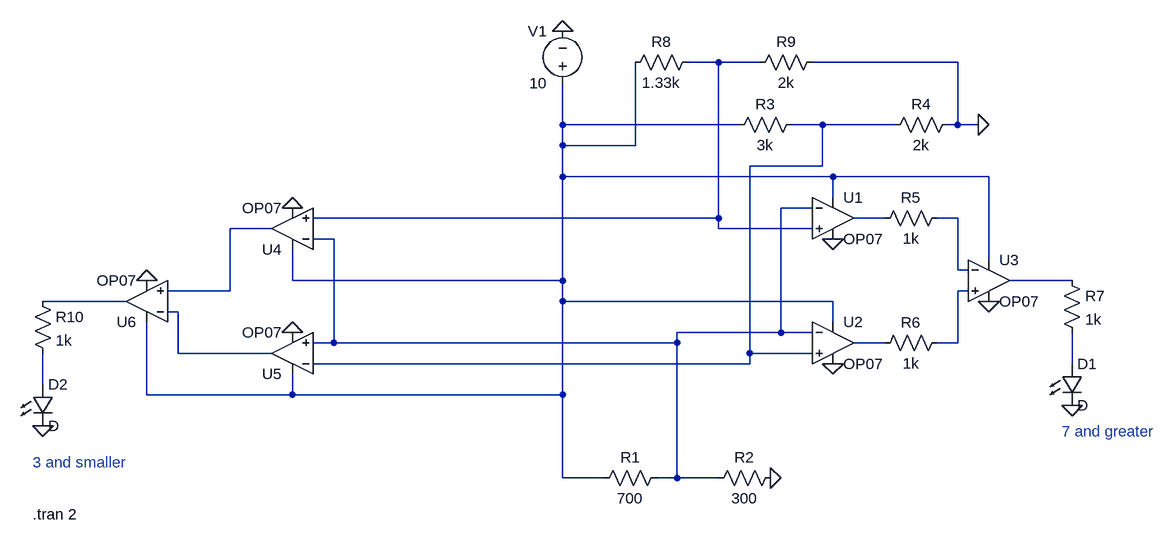
[diagram p0: schematic Heat Sink Temperature Indicator .asc]
Heat Sink Temperature Indicator .asc, the LTspice schematic file:
Version 4
SHEET 1 1120 680
WIRE 432 -208 384 -208
WIRE 496 -208 432 -208
WIRE 800 -208 576 -208
WIRE 192 -112 192 -176
WIRE 464 -112 192 -112
WIRE 592 -112 544 -112
WIRE 704 -112 592 -112
WIRE 800 -112 800 -208
WIRE 800 -112 784 -112
WIRE 832 -112 800 -112
WIRE 192 -80 192 -112
WIRE 304 -80 304 -208
WIRE 304 -80 192 -80
WIRE 592 -48 592 -112
WIRE 592 -48 480 -48
WIRE 192 -32 192 -80
WIRE 608 -32 192 -32
WIRE 848 -32 608 -32
WIRE 608 0 608 -32
WIRE 576 16 528 16
WIRE 432 32 432 -208
WIRE 432 32 -192 32
WIRE 688 32 640 32
WIRE 800 32 768 32
WIRE -256 48 -320 48
WIRE 432 48 432 32
WIRE 576 48 432 48
WIRE -160 64 -192 64
WIRE 848 96 848 -32
WIRE 800 112 800 32
WIRE 816 112 800 112
WIRE -224 128 -224 80
WIRE 192 128 192 -32
WIRE 192 128 -224 128
WIRE 976 128 880 128
WIRE -320 144 -320 48
WIRE -320 144 -416 144
WIRE 816 144 800 144
WIRE -480 160 -608 160
WIRE 192 160 192 128
WIRE 608 160 192 160
WIRE -400 176 -416 176
WIRE 608 192 608 160
WIRE 528 208 528 16
WIRE 528 208 368 208
WIRE 576 208 528 208
WIRE -160 224 -160 64
WIRE -160 224 -192 224
WIRE 368 224 368 208
WIRE 368 224 -160 224
WIRE 688 224 640 224
WIRE 800 224 800 144
WIRE 800 224 768 224
WIRE -400 240 -400 176
WIRE -256 240 -400 240
WIRE 480 240 480 -48
WIRE 576 240 480 240
WIRE 480 256 480 240
WIRE 480 256 -192 256
WIRE 976 256 976 208
WIRE -608 288 -608 240
WIRE -448 304 -448 192
WIRE -224 304 -224 272
WIRE -224 304 -448 304
WIRE 192 304 192 160
WIRE 192 304 -224 304
WIRE 192 432 192 304
WIRE 256 432 192 432
WIRE 368 432 368 224
WIRE 368 432 336 432
WIRE 432 432 368 432
FLAG 512 432 0
FLAG 192 -256 0
FLAG 832 -112 0
FLAG 976 320 0
FLAG 608 256 0
FLAG 608 64 0
FLAG 848 160 0
FLAG -224 208 0
FLAG -224 16 0
FLAG -448 128 0
FLAG -608 352 0
SYMBOL voltage 192 -160 R180
WINDOW 0 24 96 Left 2
WINDOW 3 24 16 Left 2
SYMATTR InstName V1
SYMATTR Value 10
SYMBOL res 352 416 R90
WINDOW 0 0 56 VBottom 2
WINDOW 3 32 56 VTop 2
SYMATTR InstName R1
SYMATTR Value 700
SYMBOL res 528 416 R90
WINDOW 0 0 56 VBottom 2
WINDOW 3 32 56 VTop 2
SYMATTR InstName R2
SYMATTR Value 300
SYMBOL res 560 -128 R90
WINDOW 0 0 56 VBottom 2
WINDOW 3 32 56 VTop 2
SYMATTR InstName R3
SYMATTR Value 3k
SYMBOL res 800 -128 R90
WINDOW 0 0 56 VBottom 2
WINDOW 3 32 56 VTop 2
SYMATTR InstName R4
SYMATTR Value 2k
SYMBOL OpAmps\\OP07 608 -32 R0
SYMATTR InstName U1
SYMBOL OpAmps\\OP07 608 160 R0
SYMATTR InstName U2
SYMBOL OpAmps\\OP07 848 64 R0
SYMATTR InstName U3
SYMBOL res 784 16 R90
WINDOW 0 0 56 VBottom 2
WINDOW 3 32 56 VTop 2
SYMATTR InstName R5
SYMATTR Value 1k
SYMBOL res 784 208 R90
WINDOW 0 0 56 VBottom 2
WINDOW 3 32 56 VTop 2
SYMATTR InstName R6
SYMATTR Value 1k
SYMBOL LED 960 256 R0
SYMATTR InstName D1
SYMBOL res 400 -224 R90
WINDOW 0 0 56 VBottom 2
WINDOW 3 32 56 VTop 2
SYMATTR InstName R8
SYMATTR Value 1.33k
SYMBOL res 592 -224 R90
WINDOW 0 0 56 VBottom 2
WINDOW 3 32 56 VTop 2
SYMATTR InstName R9
SYMATTR Value 2k
SYMBOL OpAmps\\OP07 -224 304 R180
SYMATTR InstName U5
SYMBOL OpAmps\\OP07 -224 112 R180
SYMATTR InstName U4
SYMBOL OpAmps\\OP07 -448 224 R180
SYMATTR InstName U6
SYMBOL LED -624 288 R0
SYMATTR InstName D2
SYMBOL res 960 112 R0
SYMATTR InstName R7
SYMATTR Value 1k
SYMBOL res -624 144 R0
SYMATTR InstName R10
SYMATTR Value 1k
TEXT -624 488 Left 2 !.tran 2
TEXT -624 408 Left 2 ;3 and smaller
TEXT 960 360 Left 2 ;7 and greater

The netlist it stands for:
* Heat Sink Temperature Indicator .asc
V1 N002 0 10
R1 N004 N002 700
R2 0 N004 300
R3 N003 N002 3k
R4 0 N003 2k
XU1 N001 N004 N002 0 N005 LT1001  ; OP07, pins In+ In- V+ V- OUT
XU2 N003 N004 N002 0 N012 LT1001  ; OP07, pins In+ In- V+ V- OUT
XU3 N009 N006 N002 0 N008 LT1001  ; OP07, pins In+ In- V+ V- OUT
R5 N006 N005 1k
R6 N009 N012 1k
D1 N013 0 D
R8 N001 N002 1.33k
R9 0 N001 2k
XU5 N004 N003 N002 0 N011 LT1001  ; OP07, pins In+ In- V+ V- OUT
XU4 N001 N004 N002 0 N007 LT1001  ; OP07, pins In+ In- V+ V- OUT
XU6 N007 N011 N002 0 N010 LT1001  ; OP07, pins In+ In- V+ V- OUT
D2 N014 0 D
R7 N008 N013 1k
R10 N010 N014 1k
.model D D
.lib standard.dio
.tran 2
* 3 and smaller
* 7 and greater
.lib LTC.lib
.backanno
.end